# EAGLE design raspi_cam_adapt (EAGLE 7.7.0)
Assembly variants: POR

## Sheet 1 of 2: TITLE_TOC
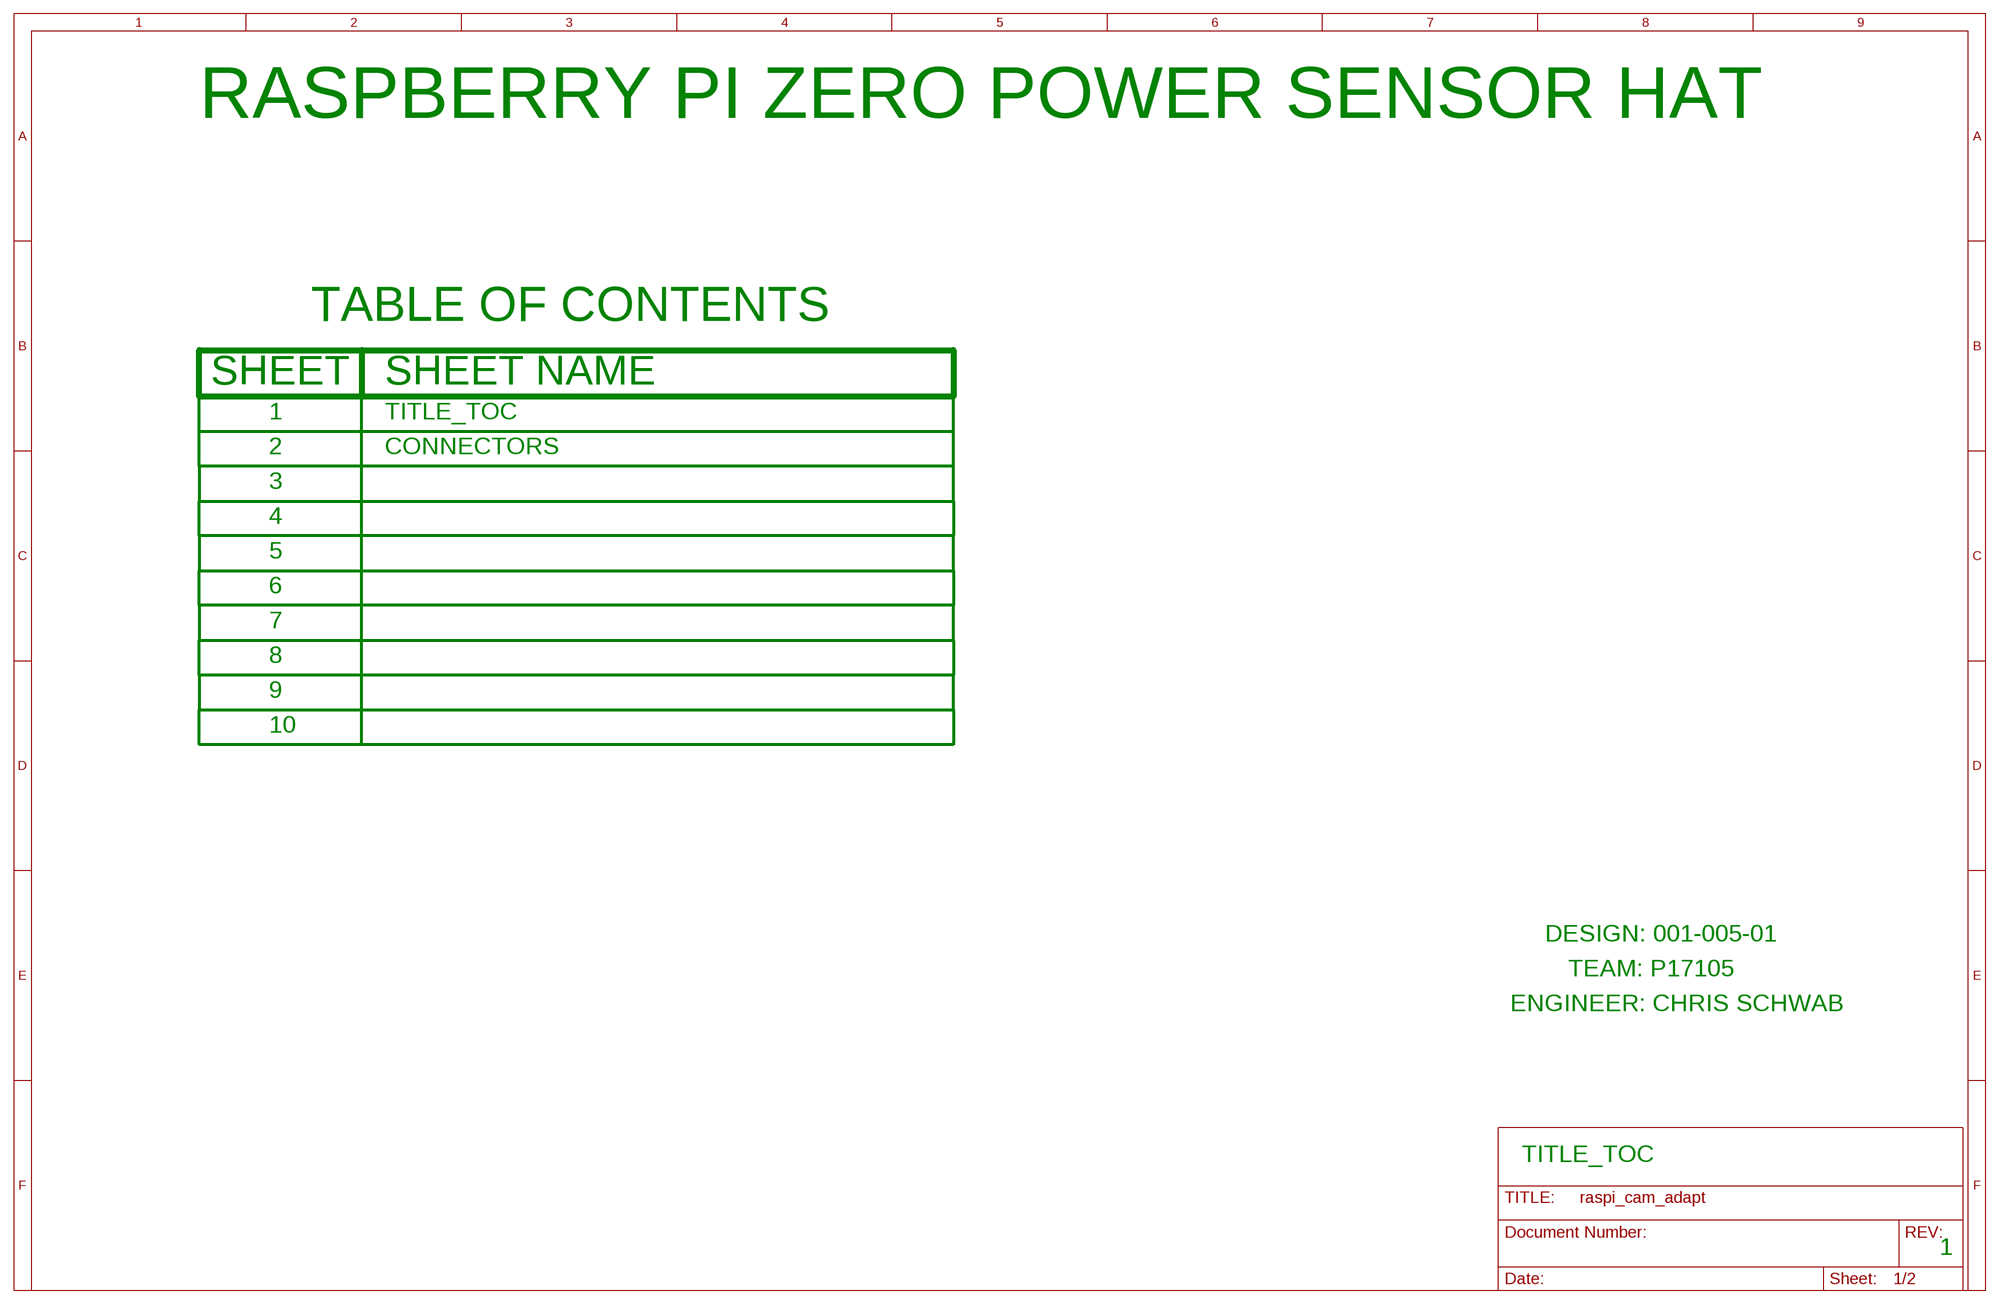
[diagram p0: schematic, sheet 1]

### Notes on the sheet
- RASPBERRY PI ZERO POWER SENSOR HAT
- TITLE_TOC
- CONNECTORS
- DESIGN: 001-005-01
- TEAM: P17105
- ENGINEER: CHRIS SCHWAB
- TITLE_TOC
- 1

## Sheet 2 of 2: CONNECTORS
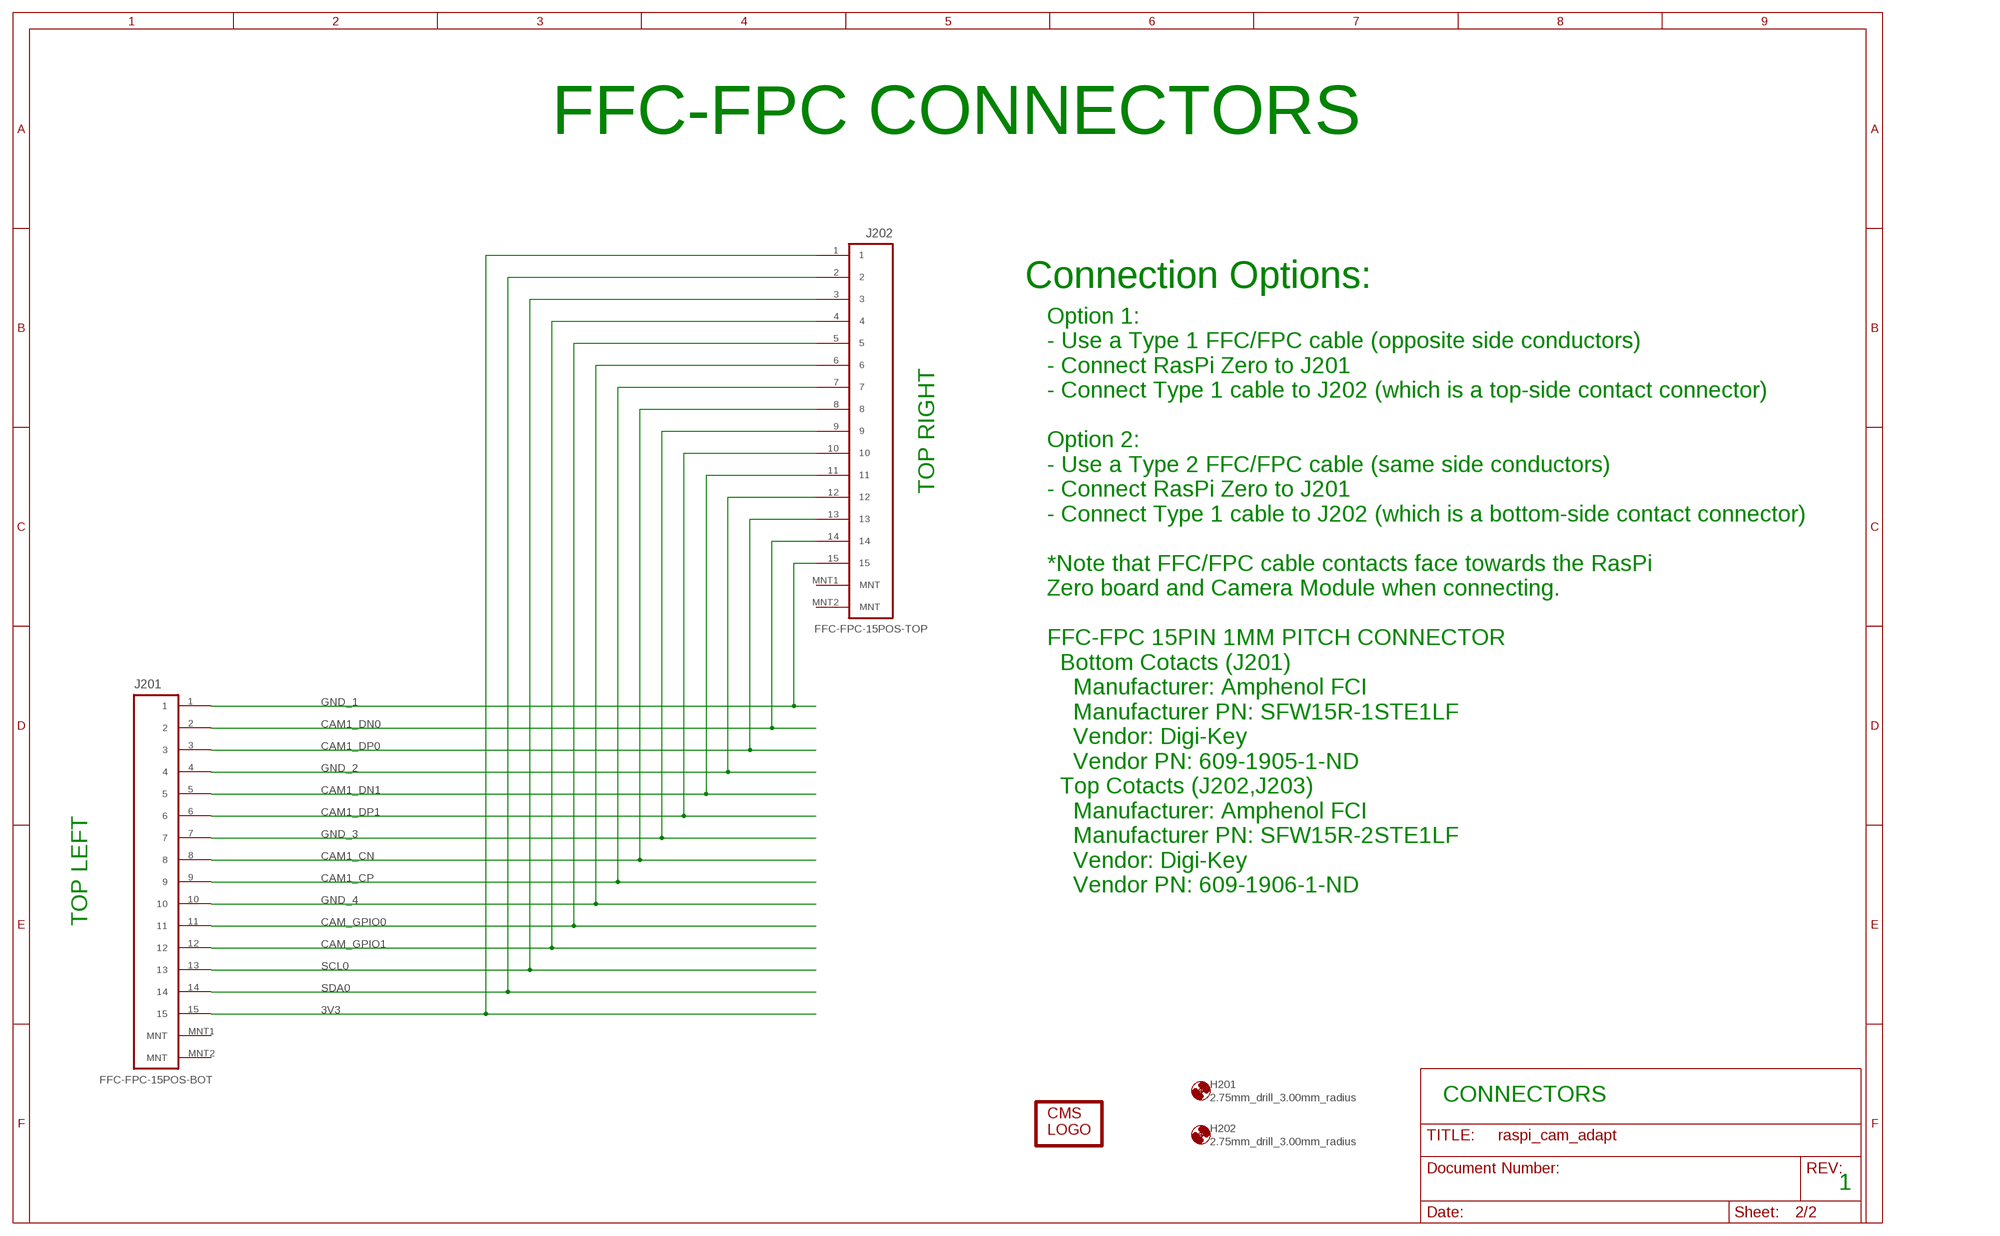
[diagram p1: schematic, sheet 2]

### Parts
H201  2.75mm_drill_3.00mm_radius  MOUNT-HOLE_2.75_3.0  [2,75_3,0_HOLE_RASPI]
H202  2.75mm_drill_3.00mm_radius  MOUNT-HOLE_2.75_3.0  [2,75_3,0_HOLE_RASPI]
J201  FFC-FPC-15POS-BOT  FFC-FPC-15POS_FFC15_BOT_SMT  [FFC-FPC-100P060X200-15N]
J202  FFC-FPC-15POS-TOP  FFC-FPC-15POS_FFC15_SMT  [FFC-FPC-100P060X200-15N]
LOGO201  CMS_LOGO  [CMS_LOGO]

### Nets
3V3: J201.15 J202.1
CAM1_CN: J201.8 J202.8
CAM1_CP: J201.9 J202.7
CAM1_DN0: J201.2 J202.14
CAM1_DN1: J201.5 J202.11
CAM1_DP0: J201.3 J202.13
CAM1_DP1: J201.6 J202.10
CAM_GPIO0: J201.11 J202.5
CAM_GPIO1: J201.12 J202.4
GND_1: J201.1 J202.15
GND_2: J201.4 J202.12
GND_3: J201.7 J202.9
GND_4: J201.10 J202.6
SCL0: J201.13 J202.3
SDA0: J201.14 J202.2
Unconnected: J201.MNT1(MNT) J201.MNT2(MNT) J202.MNT1(MNT) J202.MNT2(MNT)

### Notes on the sheet
- FFC-FPC CONNECTORS
- Connection Options:
- TOP RIGHT
- TOP LEFT
- Option 1:
  - Use a Type 1 FFC/FPC cable (opposite side conductors)
  - Connect RasPi Zero to J201
  - Connect Type 1 cable to J202 (which is a top-side contact connector)
  
  Option 2:
  - Use a Type 2 FFC/FPC cable (same side conductors)
  - Connect RasPi Zero to J201
  - Connect Type 1 cable to J202 (which is a bottom-side contact connector)
  
  *Note that FFC/FPC cable contacts face towards the RasPi
  Zero board and Camera Module when connecting.
  
  FFC-FPC 15PIN 1MM PITCH CONNECTOR
    Bottom Cotacts (J201)
      Manufacturer: Amphenol FCI
      Manufacturer PN: SFW15R-1STE1LF
      Vendor: Digi-Key
      Vendor PN: 609-1905-1-ND
    Top Cotacts (J202,J203)
      Manufacturer: Amphenol FCI
      Manufacturer PN: SFW15R-2STE1LF 
      Vendor: Digi-Key
      Vendor PN: 609-1906-1-ND
- CONNECTORS
- 1

## Library data of the parts
H201 H202 = daqcs:MOUNT-HOLE: MOUNTING HOLE with drill center marker; DATASHEET: HW/docs/projects/raspi_zero_power_sensor_hat/mechanicals/rpi-zero-v1_2_dimensions.pdf
J201 = daqcs:FFC-FPC-15POS: 15 Position FFC, FPC Connector Contacts, Top 0.039" (1.00mm) Surface Mount, Right Angle; CONTACT_LOCATION: BOTTOM; DATASHEET: /Users/cschwab/Documents/School_Work/RIT_5/Fall_2016/MSD/git_repo/HW/docs/projects/raspi_zero_power_sensor_hat/datasheets/connectors/ffc_fpc/sfw12lf.pdf; FINISH: TIN; FLEX_TYPE: FFC,FPC; LOCKING: YES; MANUFACTURER: Amphenol; MANUFACTURER_PN: SFW15R-1STE1LF; MAX_CURRENT: 1.0A; MOUNT_ANGLE: RIGHT; MOUNT_TYPE: SMT; PITCH: 1.0mm; POSITIONS: 15; VENDOR: Digi-key; VENDOR_PN: 609-1905-1-ND
J202 = daqcs:FFC-FPC-15POS: 15 Position FFC, FPC Connector Contacts, Top 0.039" (1.00mm) Surface Mount, Right Angle; CONTACT_LOCATION: TOP; DATASHEET: /Users/cschwab/Documents/School_Work/RIT_5/Fall_2016/MSD/git_repo/HW/docs/projects/raspi_zero_power_sensor_hat/datasheets/connectors/ffc_fpc/sfw12lf.pdf; FINISH: TIN; FLEX_TYPE: FFC,FPC; LOCKING: YES; MANUFACTURER: Amphenol; MANUFACTURER_PN: SFW15R-2STE1LF; MAX_CURRENT: 1.0A; MOUNT_ANGLE: RIGHT; MOUNT_TYPE: SMT; PITCH: 1.0mm; POSITIONS: 15; VENDOR: Digi-key; VENDOR_PN: 609-1906-1-ND
LOGO201 = daqcs:CMS_LOGO

## Board
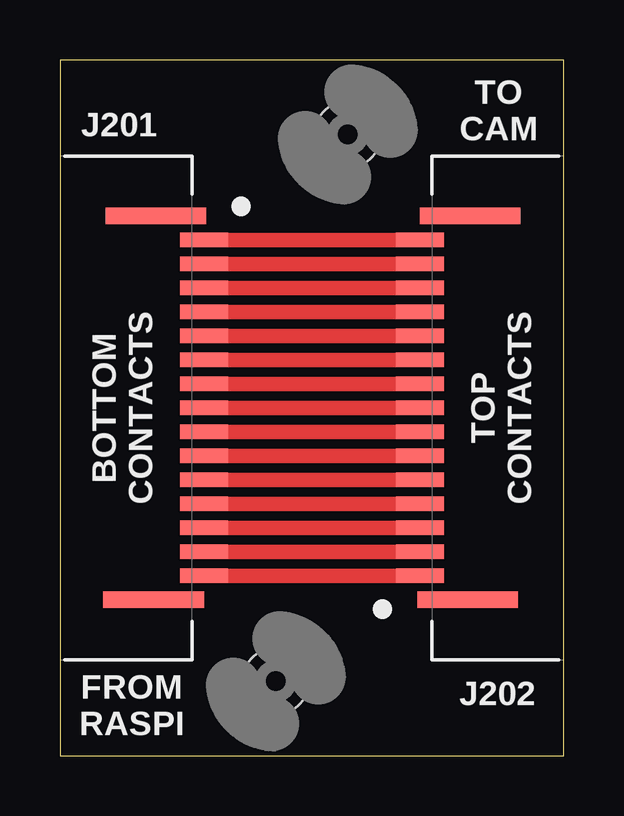
[diagram p2: board, top side]
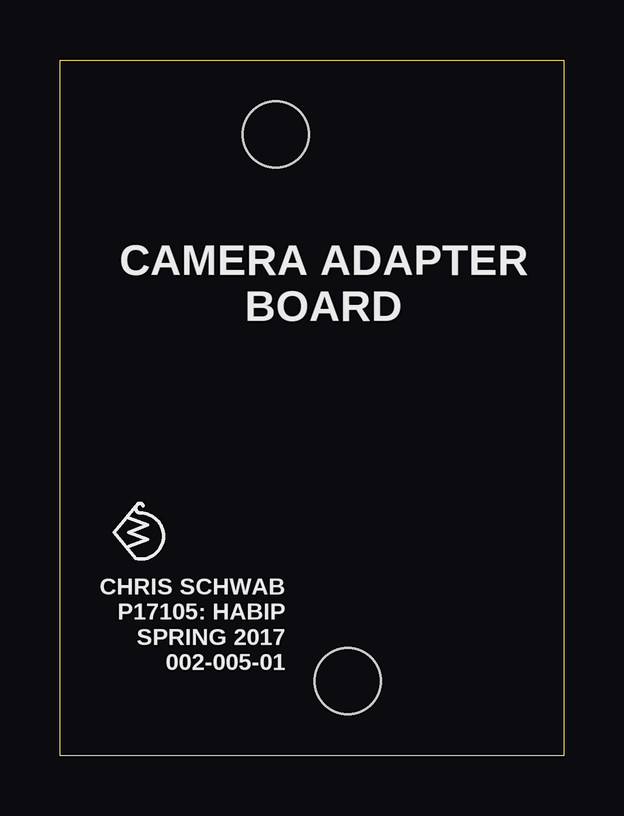
[diagram p3: board, bottom side, seen from below]

Size 21 x 29 mm. Coordinates in mm from the lower left corner, seen from the top.
Outline: 0,0 21,0 21,29 0,29 0,0
Copper layers (1+2*15+16): Top 0.035mm / dielectric 0.486mm / GND 0.035mm / dielectric 0.488mm / GND2 0.035mm / dielectric 0.486mm / Bottom 0.035mm
Design rules "4layer_4pcb": minimum track width 6mil, minimum drill 15mil, track to track 6mil, track to pad 6mil, pad to pad 6mil, via to via 6mil, smd to smd 6mil, copper to edge 20mil, drill to drill 10mil, minimum pad ring 14mil, minimum via ring 10mil, stop-mask expansion 2.5mil, vias tented up to drill 16mil, thermal gap 10mil

### Footprints (pad centres in the part's own frame; a part is rotated, then mirrored left to right if it is on the bottom)
2,75_3,0_HOLE_RASPI = hole 2.75: 0,0
FFC-FPC-100P060X200-15N = smd 0.6 x 2: 1 -7,6; 2 -6,6; 3 -5,6; 4 -4,6; 5 -3,6; 6 -2,6; 7 -1,6; 8 0,6; 9 1,6; 10 2,6; 11 3,6; 12 4,6; 13 5,6; 14 6,6; 15 7,6 | smd 0.7 x 4.2: MNT1 -8,4; MNT2 8,3.9

### Placement (x,y rotation side)
H201  12,25.9 0 top
H202  9,3.1 0 top
J201  0,14.5 270 top
J202  21,14.5 90 top
LOGO201  18.44,8.44 0 bottom

### Tracks (layer width: path | path; a pad name or v marks a point on that pad's centre or on a via)
3V3
  Top 0.6: J202.1 J201.15
CAM1_CN
  Top 0.6: J201.8 J202.8
CAM1_CP
  Top 0.6: J202.7 J201.9
CAM1_DN0
  Top 0.6: J201.2 J202.14
CAM1_DN1
  Top 0.6: J201.5 J202.11
CAM1_DP0
  Top 0.6: J201.3 J202.13
CAM1_DP1
  Top 0.6: J201.6 J202.10
CAM_GPIO0
  Top 0.6: J202.5 J201.11
CAM_GPIO1
  Top 0.6: J201.12 J202.4
GND_1
  Top 0.6: J201.1 J202.15
GND_2
  Top 0.6: J201.4 J202.12
GND_3
  Top 0.6: J202.9 J201.7
GND_4
  Top 0.6: J201.10 J202.6
SCL0
  Top 0.6: J202.3 J201.13
SDA0
  Top 0.6: J201.14 J202.2

### Text on the board
tPlace: TO / CAM | BOTTOM / CONTACTS | TOP / CONTACTS | FROM / RASPI
bPlace: CAMERA ADAPTER / BOARD | CHRIS SCHWAB / P17105: HABIP / SPRING 2017 / 002-005-01